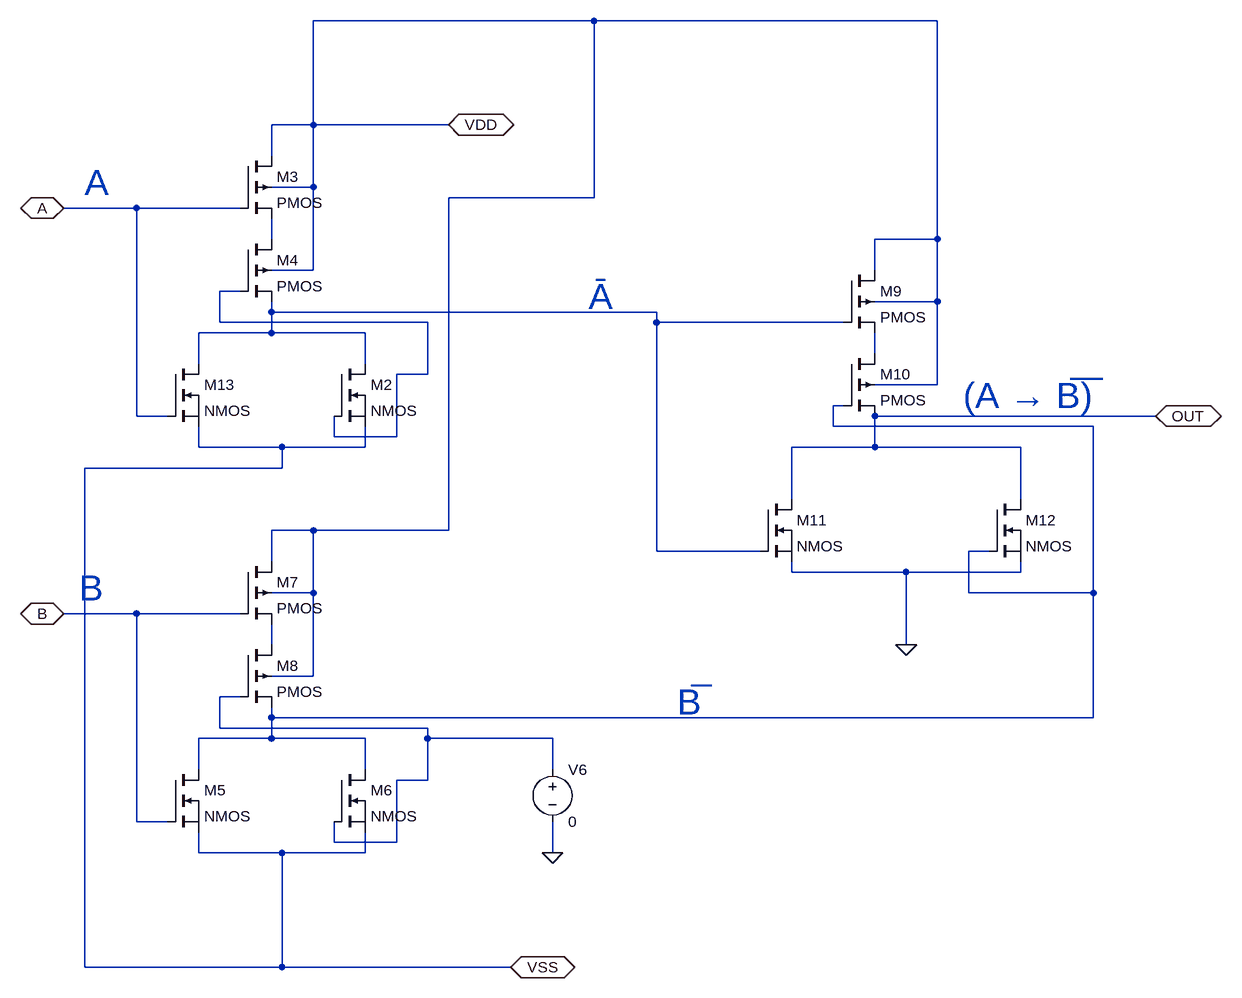
[diagram p0: schematic andgateimply.asc]
andgateimply.asc, the LTspice schematic file:
Version 4
SHEET 1 1164 968
WIRE 192 -560 -240 -560
WIRE 720 -560 192 -560
WIRE -240 -400 -240 -560
WIRE -240 -400 -304 -400
WIRE -32 -400 -240 -400
WIRE -304 -352 -304 -400
WIRE -240 -304 -240 -400
WIRE -240 -304 -304 -304
WIRE 192 -288 192 -560
WIRE 192 -288 -32 -288
WIRE -512 -272 -624 -272
WIRE -352 -272 -512 -272
WIRE -304 -224 -304 -256
WIRE 720 -224 720 -560
WIRE 720 -224 624 -224
WIRE -240 -176 -240 -304
WIRE -240 -176 -304 -176
WIRE 624 -176 624 -224
WIRE -352 -144 -384 -144
WIRE 720 -128 720 -224
WIRE 720 -128 624 -128
WIRE -304 -112 -304 -128
WIRE 288 -112 -304 -112
WIRE -384 -96 -384 -144
WIRE -64 -96 -384 -96
WIRE 288 -96 288 -112
WIRE 576 -96 288 -96
WIRE -304 -80 -304 -112
WIRE -304 -80 -416 -80
WIRE -160 -80 -304 -80
WIRE 624 -48 624 -80
WIRE -416 -32 -416 -80
WIRE -160 -32 -160 -80
WIRE -64 -16 -64 -96
WIRE -64 -16 -112 -16
WIRE 720 0 720 -128
WIRE 720 0 624 0
WIRE 576 32 560 32
WIRE -512 48 -512 -272
WIRE -464 48 -512 48
WIRE 1056 48 624 48
WIRE 560 64 560 32
WIRE 960 64 560 64
WIRE -208 80 -208 48
WIRE -112 80 -112 -16
WIRE -112 80 -208 80
WIRE -416 96 -416 64
WIRE -288 96 -416 96
WIRE -160 96 -160 64
WIRE -160 96 -288 96
WIRE 624 96 624 48
WIRE 624 96 496 96
WIRE 848 96 624 96
WIRE -288 128 -288 96
WIRE -288 128 -592 128
WIRE 496 176 496 96
WIRE 848 176 848 96
WIRE -240 224 -304 224
WIRE -32 224 -32 -288
WIRE -32 224 -240 224
WIRE 288 256 288 -96
WIRE 448 256 288 256
WIRE 800 256 768 256
WIRE -304 272 -304 224
WIRE 496 288 496 272
WIRE 672 288 496 288
WIRE 848 288 848 272
WIRE 848 288 672 288
WIRE -240 320 -240 224
WIRE -240 320 -304 320
WIRE 768 320 768 256
WIRE 960 320 960 64
WIRE 960 320 768 320
WIRE -512 352 -624 352
WIRE -352 352 -512 352
WIRE -304 400 -304 368
WIRE 672 400 672 288
WIRE -240 448 -240 320
WIRE -240 448 -304 448
WIRE -352 480 -384 480
WIRE -304 512 -304 496
WIRE 960 512 960 320
WIRE 960 512 -304 512
WIRE -384 528 -384 480
WIRE -64 528 -384 528
WIRE -304 544 -304 512
WIRE -304 544 -416 544
WIRE -160 544 -304 544
WIRE -64 544 -64 528
WIRE 128 544 -64 544
WIRE -416 592 -416 544
WIRE -160 592 -160 544
WIRE 128 592 128 544
WIRE -64 608 -64 544
WIRE -64 608 -112 608
WIRE -512 672 -512 352
WIRE -464 672 -512 672
WIRE -208 704 -208 672
WIRE -112 704 -112 608
WIRE -112 704 -208 704
WIRE -416 720 -416 688
WIRE -288 720 -416 720
WIRE -160 720 -160 688
WIRE -160 720 -288 720
WIRE 128 720 128 672
WIRE -592 896 -592 128
WIRE -288 896 -288 720
WIRE -288 896 -592 896
WIRE 64 896 -288 896
FLAG 128 720 0
FLAG 672 400 0
FLAG 1056 48 OUT
IOPIN 1056 48 BiDir
FLAG -624 -272 A
IOPIN -624 -272 BiDir
FLAG -624 352 B
IOPIN -624 352 BiDir
FLAG -32 -400 VDD
IOPIN -32 -400 BiDir
FLAG 64 896 VSS
IOPIN 64 896 BiDir
SYMBOL nmos -208 -32 R0
SYMATTR InstName M2
SYMBOL pmos4 -352 -352 R0
SYMATTR InstName M3
SYMBOL pmos4 -352 -224 R0
SYMATTR InstName M4
SYMBOL nmos -464 592 R0
SYMATTR InstName M5
SYMBOL voltage 128 576 R0
WINDOW 123 0 0 Left 0
WINDOW 39 0 0 Left 0
SYMATTR InstName V6
SYMATTR Value 0
SYMBOL nmos -208 592 R0
SYMATTR InstName M6
SYMBOL pmos4 -352 272 R0
SYMATTR InstName M7
SYMBOL pmos4 -352 400 R0
SYMATTR InstName M8
SYMBOL pmos4 576 -176 R0
SYMATTR InstName M9
SYMBOL pmos4 576 -48 R0
SYMATTR InstName M10
SYMBOL nmos 448 176 R0
SYMATTR InstName M11
SYMBOL nmos 800 176 R0
SYMATTR InstName M12
SYMBOL nmos -464 -32 R0
SYMATTR InstName M13
TEXT -592 -312 Left 5 ;A
TEXT -600 312 Left 5 ;B
TEXT 184 -136 Left 5 ;Ā
TEXT 320 488 Left 5 ;B̅
TEXT 760 16 Left 5 ;(A → B̅)̅

The netlist it stands for:
* andgateimply.asc
M2 N003 N002 VSS VSS NMOS
M3 VDD A N001 VDD PMOS
M4 N001 N002 N003 VDD PMOS
M5 N005 B VSS VSS NMOS
V6 N007 0 0
M6 N005 N007 VSS VSS NMOS
M7 VDD B N006 VDD PMOS
M8 N006 N007 N005 VDD PMOS
M9 VDD N003 N004 VDD PMOS
M10 N004 N005 OUT VDD PMOS
M11 OUT N003 0 0 NMOS
M12 OUT N005 0 0 NMOS
M13 N003 A VSS VSS NMOS
.model NMOS NMOS
.model PMOS PMOS
.lib standard.mos
* A
* B
* Ā
* B̅
* (A → B̅)̅
.backanno
.end